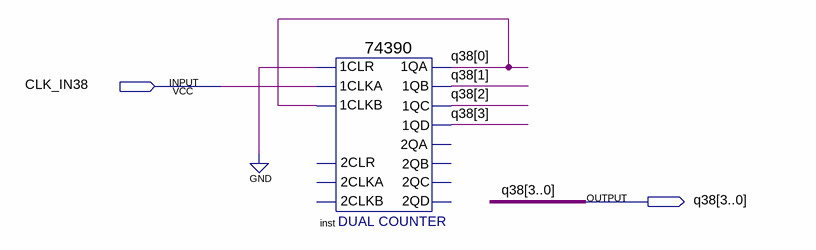
[diagram p0: schematic sheet]
// Quartus schematic cnt10_38.bdf as structural Verilog: 1 symbols, 2 pins
module cnt10_38 (
  input  CLK_IN38,
  output [3:0] q38
);

  \74390  inst (
    .\1CLR (1'b0), .\1CLKA (CLK_IN38), .\1CLKB (q38[0]), .\1QA (q38[0]), .\1QB (q38[1]), .\1QC (q38[2]),
    .\1QD (q38[3]));  // open: 2CLKA, 2CLR, 2CLKB, 2QA, 2QB, 2QC, 2QD
endmodule
